# EAGLE schematic STM32F050F Base (EAGLE 6.5.0)
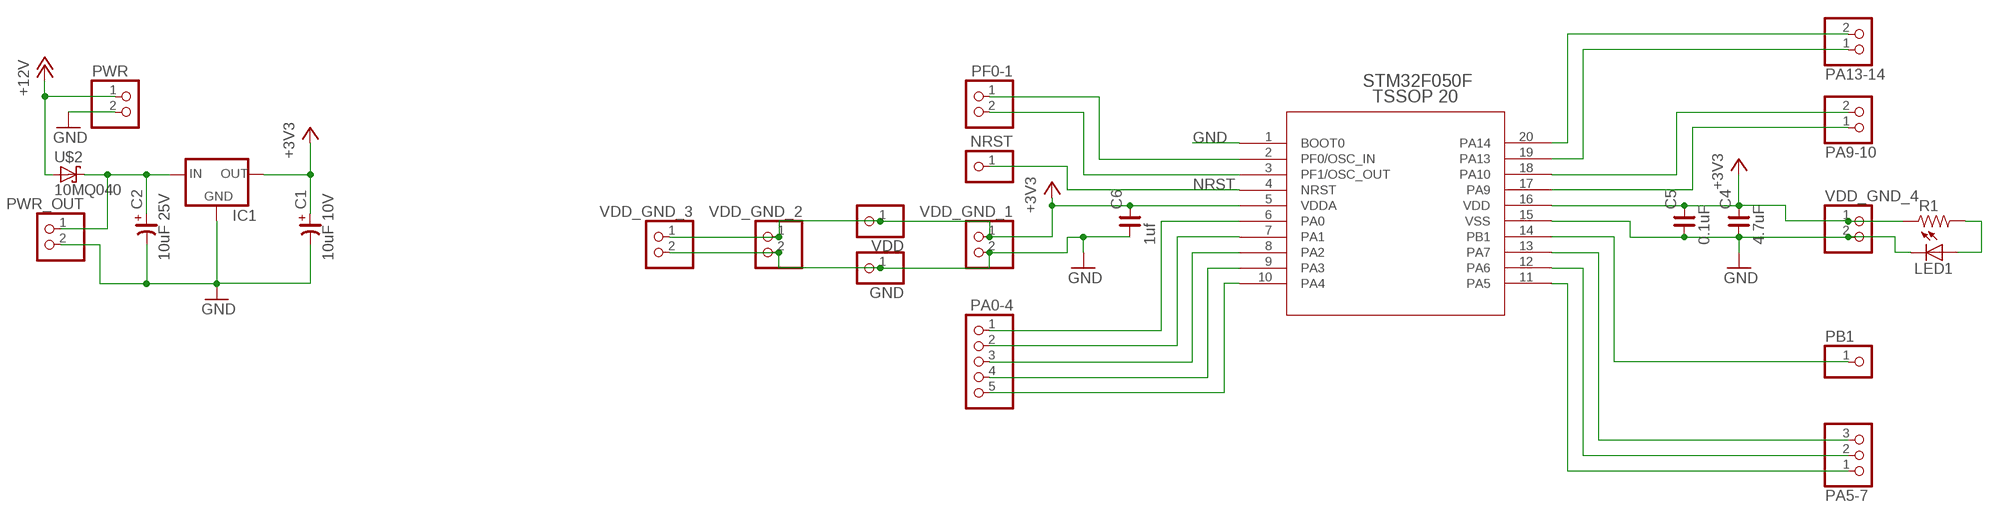
[diagram p0: schematic, sheet 1]

## Parts
C1  10uF 10V  CP_3216-18  [C3216-18/T]
C2  10uF 25V  CP_3528-21  [C3528-21/T]
C4  4.7uF  C_1206  [C1206]
C5  0.1uF  C_0805  [C0805]
C6  1uf  C_0805  [C0805]
GND  PINHD-1X01_2.54-S  [1X01-S]
IC1  LM1117  [SOT223]
LED1  LEDCHIP-LED0805  [CHIP-LED0805]
NRST  PINHD-1X01_2.54-S  [1X01-S]
PA0-4  PINHD-1X05_2.54-S  [1X05-S]
PA5-7  PINHD-1X03_2.54-S  [1X03-S]
PA9-10  PINHD-1X02_2.54-S  [1X02-S]
PA13-14  PINHD-1X02_2.54-S  [1X02-S]
PB1  PINHD-1X01_2.54-S  [1X01-S]
PF0-1  PINHD-1X02_2.54-S  [1X02-S]
PWR  PINHD-1X02_2.54-90°-S  [1X02/90-S]
PWR_OUT  PINHD-1X02_2.54-S  [1X02-S]
R1  R_0805  [R0805]
U$1  STM32F050F4P6  [TSSOP20]
U$2  10MQ040  [SMA]
VDD  PINHD-1X01_2.54-S  [1X01-S]
VDD_GND_1  PINHD-1X02_2.54-S  [1X02-S]
VDD_GND_2  PINHD-1X02_2.54-S  [1X02-S]
VDD_GND_3  PINHD-1X02_2.54-S  [1X02-S]
VDD_GND_4  PINHD-1X02_2.54-S  [1X02-S]

## Nets
+3V3: C1.+ C4.2 C5.2 C6.2 IC1.2(OUT) R1.1 U$1.5(VDDA) U$1.16(VDD) VDD.1 VDD_GND_1.1 VDD_GND_2.1 VDD_GND_3.1 VDD_GND_4.1
+12V: PWR.1 U$2.A
GND: C1.- C2.- C4.1 C5.1 C6.1 GND.1 IC1.1(GND) LED1.C PWR.2 PWR_OUT.2 U$1.1(BOOT0) U$1.15(VSS) VDD_GND_1.2 VDD_GND_2.2 VDD_GND_3.2 VDD_GND_4.2
N$2: LED1.A R1.2
N$6: PA13-14.2 U$1.20(PA14)
N$7: PA13-14.1 U$1.19(PA13)
N$8: PF0-1.1 U$1.2(PF0/OSC_IN)
N$9: PF0-1.2 U$1.3(PF1/OSC_OUT)
N$10: PA5-7.1 U$1.11(PA5)
N$11: PA0-4.1 U$1.6(PA0)
N$12: PA0-4.2 U$1.7(PA1)
N$13: PA0-4.3 U$1.8(PA2)
N$14: PA0-4.4 U$1.9(PA3)
N$15: PA0-4.5 U$1.10(PA4)
N$16: PA5-7.2 U$1.12(PA6)
N$17: PA5-7.3 U$1.13(PA7)
N$18: PB1.1 U$1.14(PB1)
N$19: PA9-10.1 U$1.17(PA9)
N$20: PA9-10.2 U$1.18(PA10)
N$23: C2.+ IC1.3(IN) PWR_OUT.1 U$2.C
NRST: NRST.1 U$1.4(NRST)

## Library data of the parts
C1 C2 = rc-master-smd:CP_: POLARIZED CAP
C4-C6 = rc-master-smd:C_: NON-POLARIZED CAP
GND NRST PB1 VDD = pinhead-2:PINHD-1X01: PIN HEADER
IC1 = v-reg-3:LM1117
LED1 = led:LED: LED OSRAM: - CHIPLED LG R971, LG N971, LY N971, LG Q971, LY Q971, LO R971, LY R971 LH N974, LH R974 LS Q976, LO Q976, LY Q976 LO Q996 - Hyper CHIPLED LW Q18S LB Q993, LB Q99A, LB R99A - SideLED LS A670, LO A670, LY A670, LG A670, LP A670 LB A673, LV A673, LT A673, LW A673 LH A674 LY A675 LS A676, LA A676, LO A676, LY A676, LW A676 LS A679, LY A679, LG A679 - Hyper Micro SIDELED® LS Y876, LA Y876, LO Y876, LY Y876 LT Y87S - SmartLED LW L88C, LW L88S LB L89C, LB L89S, LG L890 LS L89K, LO L89K, LY L89K LS L896, LA L896, LO L896, LY L896 - TOPLED LS T670, LO T670, LY T670, LG T670, LP T670 LSG T670, LSP T670, LSY T670, LOP T670, LYG T670 LG T671, LOG T671, LSG T671 LB T673, LV T673, LT T673, LW T673 LH T674 LS T676, LA T676, LO T676, LY T676, LB T676, LH T676, LSB T676, LW T676 LB T67C, LV T67C, LT T67C, LS T67K, LO T67K, LY T67K, LW E67C LS E67B, LA E67B, LO E67B, LY E67B, LB E67C, LV E67C, LT E67C LW T67C LS T679, LY T679, LG T679 LS T770, LO T770, LY T770, LG T770, LP T770 LB T773, LV T773, LT T773, LW T773 LH T774 LS E675, LA E675, LY E675, LS T675 LS T776, LA T776, LO T776, LY T776, LB T776 LHGB T686 LT T68C, LB T68C - Hyper Mini TOPLED® LB M676 - Mini TOPLED Santana® LG M470 LS M47K, LO M47K, LY M47K Source: http://www.osram.convergy.de LUXEON: - LUMILED® LXK2-PW12-R00, LXK2-PW12-S00, LXK2-PW14-U00, LXK2-PW14-V00 LXK2-PM12-R00, LXK2-PM12-S00, LXK2-PM14-U00 LXK2-PE12-Q00, LXK2-PE12-R00, LXK2-PE12-S00, LXK2-PE14-T00, LXK2-PE14-U00 LXK2-PB12-K00, LXK2-PB12-L00, LXK2-PB12-M00, LXK2-PB14-N00, LXK2-PB14-P00, LXK2-PB14-Q00 LXK2-PR12-L00, LXK2-PR12-M00, LXK2-PR14-Q00, LXK2-PR14-R00 LXK2-PD12-Q00, LXK2-PD12-R00, LXK2-PD12-S00 LXK2-PH12-R00, LXK2-PH12-S00 LXK2-PL12-P00, LXK2-PL12-Q00, LXK2-PL12-R00 Source: www.luxeon.com KINGBRIGHT: KA-3528ASYC Source: www.kingbright.com
PA0-4 = pinhead-2:PINHD-1X05: PIN HEADER
PA5-7 = pinhead-2:PINHD-1X03: PIN HEADER
PA9-10 PA13-14 PF0-1 PWR PWR_OUT VDD_GND_1-VDD_GND_4 = pinhead-2:PINHD-1X02: PIN HEADER
R1 = rc-master-smd:R_: RESISTOR
U$1 = STM32F0:STM32F050F4P6: STM32F050F4P6
U$2 = my-library:10MQ040: SCHOTTKY